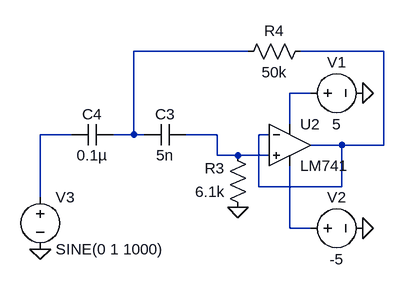
[diagram p0: schematic Lab9_2.asc]
Lab9_2.asc, the LTspice schematic file:
Version 4.1
SHEET 1 880 680
WIRE -320 -384 -496 -384
WIRE -112 -384 -240 -384
WIRE -224 -320 -256 -320
WIRE -256 -272 -256 -320
WIRE -592 -256 -640 -256
WIRE -496 -256 -496 -384
WIRE -496 -256 -528 -256
WIRE -480 -256 -496 -256
WIRE -368 -256 -416 -256
WIRE -288 -256 -304 -256
WIRE -176 -240 -224 -240
WIRE -112 -240 -112 -384
WIRE -112 -240 -176 -240
WIRE -368 -224 -368 -256
WIRE -336 -224 -368 -224
WIRE -288 -224 -336 -224
WIRE -304 -176 -304 -256
WIRE -176 -176 -176 -240
WIRE -176 -176 -304 -176
WIRE -640 -160 -640 -256
WIRE -256 -112 -256 -208
WIRE -224 -112 -256 -112
FLAG -336 -144 0
FLAG -144 -320 0
FLAG -144 -112 0
FLAG -640 -80 0
SYMBOL cap -416 -272 R90
WINDOW 0 0 32 VBottom 2
WINDOW 3 32 32 VTop 2
SYMATTR InstName C3
SYMATTR Value 5n
SYMBOL cap -528 -272 R90
WINDOW 0 0 32 VBottom 2
WINDOW 3 32 32 VTop 2
SYMATTR InstName C4
SYMATTR Value 0.1µ
SYMBOL res -320 -128 R180
WINDOW 0 36 76 Left 2
WINDOW 3 36 40 Left 2
SYMATTR InstName R3
SYMATTR Value 6.1k
SYMBOL res -224 -400 R90
WINDOW 0 0 56 VBottom 2
WINDOW 3 32 56 VTop 2
SYMATTR InstName R4
SYMATTR Value 50k
SYMBOL LM741 -256 -304 R0
SYMATTR InstName U2
SYMBOL voltage -240 -320 R270
WINDOW 0 32 56 VTop 2
WINDOW 3 -32 56 VBottom 2
WINDOW 123 0 0 Left 0
WINDOW 39 0 0 Left 0
SYMATTR InstName V1
SYMATTR Value 5
SYMBOL voltage -240 -112 R270
WINDOW 0 32 56 VTop 2
WINDOW 3 -32 56 VBottom 2
WINDOW 123 0 0 Left 0
WINDOW 39 0 0 Left 0
SYMATTR InstName V2
SYMATTR Value -5
SYMBOL voltage -640 -176 R0
WINDOW 123 0 0 Left 0
WINDOW 39 0 0 Left 0
SYMATTR InstName V3
SYMATTR Value SINE(0 1 1000)

The netlist it stands for:
* Lab9_2.asc
C3 N005 N001 5n
C4 N001 N004 0.1µ
R3 0 N005 6.1k
R4 N002 N001 50k
X§U2 N005 N002 N003 N006 N002 LM741  ; pins In+ In- V+ V- OUT
V1 N003 0 5
V2 N006 0 -5
V3 N004 0 SINE(0 1 1000)
.lib LM741.lib
.backanno
.end